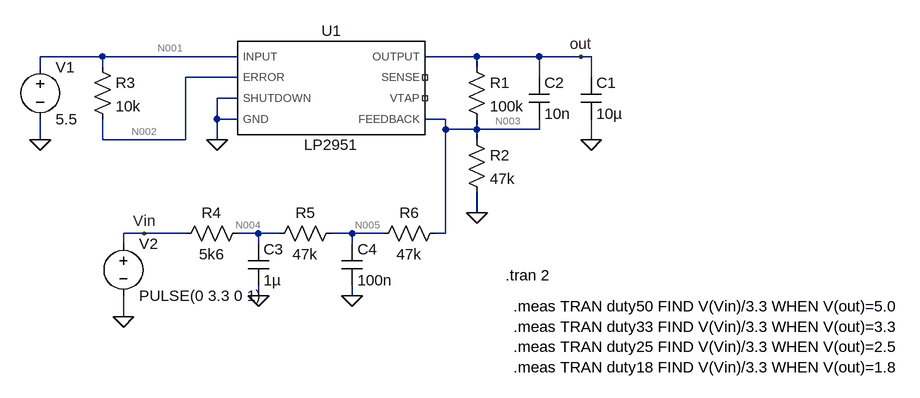
[diagram p0: schematic LDO.asc]
LDO.asc, the LTspice schematic file:
Version 4
SHEET 1 1200 680
WIRE -32 144 -128 144
WIRE 176 144 -32 144
WIRE 544 144 464 144
WIRE 640 144 544 144
WIRE 704 144 640 144
WIRE 720 144 704 144
WIRE -128 160 -128 144
WIRE -32 160 -32 144
WIRE 544 160 544 144
WIRE 176 176 96 176
WIRE 640 176 640 144
WIRE 720 176 720 144
WIRE 176 208 144 208
WIRE 144 240 144 208
WIRE 176 240 144 240
WIRE 496 240 464 240
WIRE 496 256 496 240
WIRE 544 256 544 240
WIRE 544 256 496 256
WIRE 640 256 640 240
WIRE 640 256 544 256
WIRE -128 272 -128 240
WIRE -32 272 -32 240
WIRE 96 272 96 176
WIRE 96 272 -32 272
WIRE 144 272 144 240
WIRE 544 272 544 256
WIRE 720 272 720 240
WIRE 544 384 544 352
WIRE 32 416 0 416
WIRE 96 416 32 416
WIRE 208 416 176 416
WIRE 240 416 208 416
WIRE 352 416 320 416
WIRE 400 416 352 416
WIRE 496 416 496 256
WIRE 496 416 480 416
WIRE 0 432 0 416
WIRE 208 432 208 416
WIRE 352 432 352 416
WIRE 208 512 208 496
WIRE 352 512 352 496
WIRE 0 544 0 512
FLAG 144 272 0
FLAG -128 272 0
FLAG 544 384 0
FLAG 720 272 0
FLAG 704 144 out
FLAG 208 512 0
FLAG 352 512 0
FLAG 0 544 0
FLAG 32 416 Vin
SYMBOL LP2951 320 192 R0
SYMATTR InstName U1
SYMBOL voltage -128 144 R0
WINDOW 123 0 0 Left 2
WINDOW 39 0 0 Left 2
SYMATTR InstName V1
SYMATTR Value 5.5
SYMBOL res 528 144 R0
SYMATTR InstName R1
SYMATTR Value 100k
SYMBOL res 528 256 R0
SYMATTR InstName R2
SYMATTR Value 47k
SYMBOL cap 704 176 R0
SYMATTR InstName C1
SYMATTR Value 10µ
SYMBOL cap 624 176 R0
SYMATTR InstName C2
SYMATTR Value 10n
SYMBOL res -48 144 R0
SYMATTR InstName R3
SYMATTR Value 10k
SYMBOL res 192 400 R90
WINDOW 0 0 56 VBottom 2
WINDOW 3 32 56 VTop 2
SYMATTR InstName R4
SYMATTR Value 5k6
SYMBOL res 336 400 R90
WINDOW 0 0 56 VBottom 2
WINDOW 3 32 56 VTop 2
SYMATTR InstName R5
SYMATTR Value 47k
SYMBOL cap 192 432 R0
SYMATTR InstName C3
SYMATTR Value 1µ
SYMBOL cap 336 432 R0
SYMATTR InstName C4
SYMATTR Value 100n
SYMBOL voltage 0 416 R0
WINDOW 123 0 0 Left 2
WINDOW 39 0 0 Left 2
SYMATTR InstName V2
SYMATTR Value PULSE(0 3.3 0 1)
SYMBOL res 496 400 R90
WINDOW 0 0 56 VBottom 2
WINDOW 3 32 56 VTop 2
SYMATTR InstName R6
SYMATTR Value 47k
TEXT 588 480 Left 2 !.tran 2
TEXT 600 528 Left 2 !.meas TRAN duty50 FIND V(Vin)/3.3 WHEN V(out)=5.0\n.meas TRAN duty33 FIND V(Vin)/3.3 WHEN V(out)=3.3\n.meas TRAN duty25 FIND V(Vin)/3.3 WHEN V(out)=2.5\n.meas TRAN duty18 FIND V(Vin)/3.3 WHEN V(out)=1.8

The netlist it stands for:
* LDO.asc
XU1 out NC_01 0 0 N002 NC_02 N003 N001 LP2951  ; pins OUTPUT SENSE SHUTDOWN GND ERROR VTAP FEEDBACK INPUT
V1 N001 0 5.5
R1 out N003 100k
R2 N003 0 47k
C1 out 0 10µ
C2 out N003 10n
R3 N001 N002 10k
R4 N004 Vin 5k6
R5 N005 N004 47k
C3 N004 0 1µ
C4 N005 0 100n
V2 Vin 0 PULSE(0 3.3 0 1)
R6 N003 N005 47k
.tran 2
.meas TRAN duty50 FIND V(Vin)/3.3 WHEN V(out)=5.0
.meas TRAN duty33 FIND V(Vin)/3.3 WHEN V(out)=3.3
.meas TRAN duty25 FIND V(Vin)/3.3 WHEN V(out)=2.5
.meas TRAN duty18 FIND V(Vin)/3.3 WHEN V(out)=1.8
.lib D:\OneDrive\super_UART\sim\LP2951.lib
.backanno
.end

* Results of the author's LTspice run, read from the files saved beside the schematic
* Operating Point, zero values left out:
*   V(n002) = 5.494 V
*   V(n001) = 5.5 V
*   V(out) = 5.103 V
*   V(n003) = 1.235 V
*   V(n004) = 69.44 mV
*   V(n005) = 652.2 mV
*   I(R6) = 12.4 µA
*   I(R5) = 12.4 µA
*   I(R4) = 12.4 µA
*   I(R3) = 554.9 nA
*   I(R2) = 26.28 µA
*   I(R1) = 38.68 µA
*   I(V2) = 12.4 µA
*   I(V1) = -39.27 µA
*   Ix(u1:OUTPUT) = -38.68 µA
*   Ix(u1:GND) = -555.8 nA
*   Ix(u1:ERROR) = 554.9 nA
*   Ix(u1:INPUT) = 38.72 µA
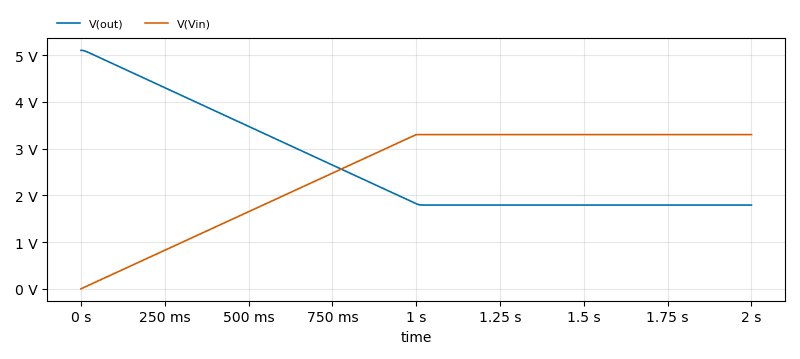
[diagram p1: Transient Analysis of LDO.asc, plotted from the saved traces]
* Transient Analysis, 1 run:
*   V(out): min 1.792 V, max 5.103 V, average 2.634 V, rms 2.862 V, last 1.792 V
*   V(Vin): min 0 V, max 3.3 V, average 2.475 V, rms 2.71 V, last 3.3 V
* From the log:
*   duty50: v(vin)/3.3=0.0397698 at 0.0397698
*   duty33: v(vin)/3.3=0.553121 at 0.553121
*   duty25: v(vin)/3.3=0.794806 at 0.794806
*   duty18: v(vin)/3.3=1 at 1.00875